# Altium schematic sheet AltiumTemplates.SchDoc
size A4
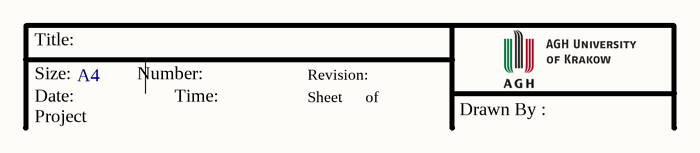
[diagram p0: AltiumTemplates.SchDoc]

## Notes on the sheet
- Title:
- Size:
- Date:
- A4
- Number:
- Time:
- Revision:
- Sheet
- of
- Project
- Drawn By :